# Altium schematic sheet Sheet1.SchDoc
size A
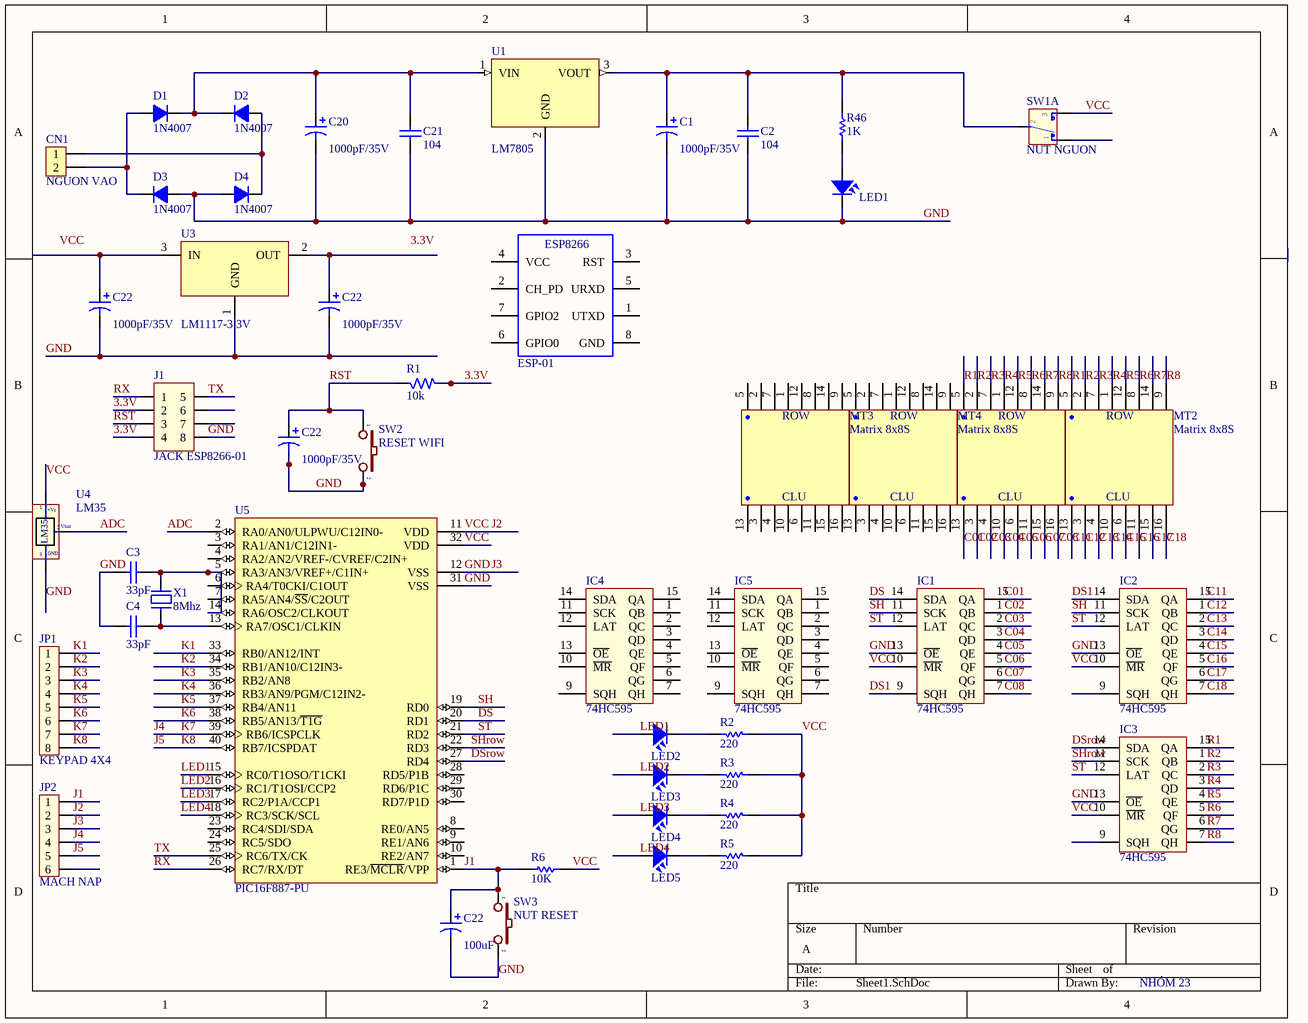
[diagram p0: Sheet1.SchDoc]

## Parts
(Parts that share a designator on the sheet are numbered #1, #2 ... from top to bottom, then left to right.)
C1  value 1000pF/35V  [CP2/5]
C2  104  [CNP]
C3  33pF  [CNP]
C4  33pF  [CNP]
C20  value 1000pF/35V  [CP2/5]
C21  104  [CNP]
C22#1  value 1000pF/35V  [CP2/5]
C22#2  value 1000pF/35V  [CP2/5]
C22#3  value 1000pF/35V  [CP2/5]
C22#4  value 100uF  [CP2/5]
CN1  NGUON VAO  [Header 2x1 straight]
D1  1N4007  [D1A]
D2  1N4007  [D1A]
D3  1N4007  [D1A]
D4  1N4007  [D1A]
IC1  74HC595  [DIP16]
IC2  74HC595  [DIP16]
IC3  74HC595  [DIP16]
IC4  74HC595  [DIP16/W0.3]
IC5  74HC595  [DIP16/W0.3]
J1  JACK ESP8266-01  [JP4x2]
JP1  KEYPAD 4X4  [JP8]
JP2  MACH NAP  [JP6]
LED1  LED  [LED-3]  (value not drawn)
LED2  LED  [LED-3]  (value not drawn)
LED3  LED  [LED-3]  (value not drawn)
LED4  LED  [LED-3]  (value not drawn)
LED5  LED  [LED-3]  (value not drawn)
MT1  Matrix 8x8S  [Matrix]
MT2  Matrix 8x8S  [Matrix]
MT3  Matrix 8x8S  [8x8S]
MT4  Matrix 8x8S  [8x8S]
R1  10k  [SM-RES-1206]
R2  value 220  [R1/4W]  (hidden comment: Res1)
R3  value 220  [R1/4W]  (hidden comment: Res1)
R4  value 220  [R1/4W]  (hidden comment: Res1)
R5  value 220  [R1/4W]  (hidden comment: Res1)
R6  value 10K  [R1/4W]  (hidden comment: Res1)
R46  value 1K  [R1/4W]  (hidden comment: Res1)
SW1  NUT NGUON  [SW6]  (part A of 2)
SW2  RESET WIFI  [SW2]
SW3  NUT RESET  [SW2]
U1  LM7805  [TO-220]
U2  ESP-01  [ESP8266]
U3  LM1117-3.3V  [SOT223]
U4  LM35  [TO92-123]
U5  PIC16F887-PU  [DIP40/W0.6]
X1  8Mhz  [XT2]

## Nets
GND: C1.2 C2.1 C3.2 C4.2 C20.2 C21.1 C22#1.2 C22#2.2 C22#3.2 C22#4.2 D3.1(A) D4.1(A) IC1.8(GND) IC1.13(~{OE}) IC2.8(GND) IC2.13(~{OE}) IC3.8(GND) IC3.13(~{OE}) IC4.8(GND) IC5.8(GND) J1.8 JP2.3 LED1.2 SW2.2 SW3.2 U1.2(GND) U3.1(GND) U4.3(-) U5.12(VSS) U5.31(VSS)  [also labelled J3]
J2: IC1.10(~{MR}) IC1.16(VCC) IC2.10(~{MR}) IC2.16(VCC) IC3.10(~{MR}) IC3.16(VCC) IC4.16(VCC) IC5.16(VCC) JP2.2 R2.1 R3.1 R4.1 R5.1 R6.1 SW1.3 U4.1(+Vs) U5.11(VDD) U5.32(VDD)  [also labelled VCC]
3.3V: J1.2 J1.4 R1.2
ADC: U4.2(Vout) U5.2(RA0/AN0/ULPWU/C12IN0-)
C01: IC1.15(QA) MT1.13(C1)
C02: IC1.1(QB) MT1.3(C2)
C03: IC1.2(QC) MT1.4(C3)
C04: IC1.3(QD) MT1.10(C4)
C05: IC1.4(QE) MT1.6(C5)
C06: IC1.5(QF) MT1.11(C6)
C07: IC1.6(QG) MT1.15(C7)
C08: IC1.7(QH) MT1.16(C8)
C11: IC2.15(QA) MT2.13(C1)
C12: IC2.1(QB) MT2.3(C2)
C13: IC2.2(QC) MT2.4(C3)
C14: IC2.3(QD) MT2.10(C4)
C15: IC2.4(QE) MT2.6(C5)
C16: IC2.5(QF) MT2.11(C6)
C17: IC2.6(QG) MT2.15(C7)
C18: IC2.7(QH) MT2.16(C8)
DS: IC1.14(SDA) U5.20(RD1)
DS1: IC1.9(SQH) IC2.14(SDA)
DSrow: IC3.14(SDA) U5.27(RD4)
J1: C22#4.1 JP2.1 R6.2 SW3.1 U5.1(RE3/~{MCLR}/VPP)
J4: JP1.7 JP2.4 U5.39(RB6/ICSPCLK)  [also labelled K7]
J5: JP1.8 JP2.5 U5.40(RB7/ICSPDAT)  [also labelled K8]
K1: JP1.1 U5.33(RB0/AN12/INT)
K2: JP1.2 U5.34(RB1/AN10/C12IN3-)
K3: JP1.3 U5.35(RB2/AN8)
K4: JP1.4 U5.36(RB3/AN9/PGM/C12IN2-)
K5: JP1.5 U5.37(RB4/AN11)
K6: JP1.6 U5.38(RB5/AN13/~{T1G})
LED1: LED2.1 U5.15(RC0/T1OSO/T1CKI)
LED2: LED3.1 U5.16(RC1/T1OSI/CCP2)
LED3: LED4.1 U5.17(RC2/P1A/CCP1)
LED4: LED5.1 U5.18(RC3/SCK/SCL)
R1: IC3.15(QA) MT1.5(H1) MT2.5(H1)
R2: IC3.1(QB) MT1.2(H2) MT2.2(H2)
R3: IC3.2(QC) MT1.7(H3) MT2.7(H3)
R4: IC3.3(QD) MT1.1(H4) MT2.1(H4)
R5: IC3.4(QE) MT1.12(H5) MT2.12(H5)
R6: IC3.5(QF) MT1.8(H6) MT2.8(H6)
R7: IC3.6(QG) MT1.14(H7) MT2.14(H7)
R8: IC3.7(QH) MT1.9(H8) MT2.9(H8)
RST: C22#3.1 J1.3 R1.1 SW2.1
RX: J1.1 U5.26(RC7/RX/DT)
SH: IC1.11(SCK) IC2.11(SCK) U5.19(RD0)
SHrow: IC3.11(SCK) U5.22(RD3)
ST: IC1.12(LAT) IC2.12(LAT) IC3.12(LAT) U5.21(RD2)
TX: J1.5 U5.25(RC6/TX/CK)
NetC1_1: C1.1 C2.2 R46.2 SW1.2 U1.3(VOUT)
NetC3_1: C3.1 U5.5(RA3/AN3/VREF+/C1IN+) U5.14(RA6/OSC2/CLKOUT) X1.2
NetC4_1: C4.1 U5.13(RA7/OSC1/CLKIN) X1.1
NetC20_1: C20.1 C21.2 D1.2(K) D2.2(K) U1.1(VIN)
NetC22#1_1: C22#1.1 U3.3(IN)
NetC22#2_1: C22#2.1 U3.2(OUT)
NetCN1_1: CN1.1 D2.1(A) D4.2(K)
NetCN1_2: CN1.2 D1.1(A) D3.2(K)
NetLED1_1: LED1.1 R46.1
NetLED2_2: LED2.2 R2.2
NetLED3_2: LED3.2 R3.2
NetLED4_2: LED4.2 R4.2
NetLED5_2: LED5.2 R5.2

Not connected (* = marked no-connect by the designer): IC2 9(SQH); IC3 9(SQH); IC4 1(QB) 2(QC) 3(QD) 4(QE) 5(QF) 6(QG) 7(QH) 9(SQH) 10(~{MR}) 11(SCK) 12(LAT) 13(~{OE}) 14(SDA) 15(QA); IC5 1(QB) 2(QC) 3(QD) 4(QE) 5(QF) 6(QG) 7(QH) 9(SQH) 10(~{MR}) 11(SCK) 12(LAT) 13(~{OE}) 14(SDA) 15(QA); J1 6 7; JP2 6; MT3 1(H4) 2(H2) 3(C2) 4(C3) 5(H1) 6(C5) 7(H3) 8(H6) 9(H8) 10(C4) 11(C6) 12(H5) 13(C1) 14(H7) 15(C7) 16(C8); MT4 1(H4) 2(H2) 3(C2) 4(C3) 5(H1) 6(C5) 7(H3) 8(H6) 9(H8) 10(C4) 11(C6) 12(H5) 13(C1) 14(H7) 15(C7) 16(C8); SW1 1; U2 1(UTXD) 2(CH_PD) 3(RST) 4(VCC) 5(URXD) 6(GPIO0) 7(GPIO2) 8(GND); U5 3(RA1/AN1/C12IN1-) 4(RA2/AN2/VREF-/CVREF/C2IN+) 6(RA4/T0CKI/C1OUT) 7(RA5/AN4/~{SS}/C2OUT) 8(RE0/AN5) 9(RE1/AN6) 10(RE2/AN7) 23(RC4/SDI/SDA) 24(RC5/SDO) 28(RD5/P1B) 29(RD6/P1C) 30(RD7/P1D)

## Notes on the sheet
- NHÓM 23
- Labels drawn without touching a wire or pin: 3.3V, VCC
- (in symbol ESP8266-01) ESP8266
- (in symbol LED 8x8S) ROW; CLU
- (in symbol LM35) GND

## Library data of the parts
C1 C20 = Cap Pol3_2: Polarized Capacitor (Surface Mount); VALUE: C?; LatestRevisionDate: 17-Jul-2002; LatestRevisionNote: Re-released for DXP Platform.; PackageReference: C0805; Publisher: Altium Limited
C2 C21 = Cap Semi_2: Capacitor (Semiconductor SIM Model); LatestRevisionDate: 17-Jul-2002; LatestRevisionNote: Re-released for DXP Platform.; PackageReference: C1206; Publisher: Altium Limited; Value: 104
C3 C4 = Cap Semi_2: Capacitor (Semiconductor SIM Model); Value: 104; LatestRevisionDate: 17-Jul-2002; LatestRevisionNote: Re-released for DXP Platform.; PackageReference: C1206; Publisher: Altium Limited
C22#1-C22#4 = Cap Pol3: Polarized Capacitor (Surface Mount); VALUE: C?; LatestRevisionDate: 17-Jul-2002; LatestRevisionNote: Re-released for DXP Platform.; PackageReference: C0805; Publisher: Altium Limited
CN1 = Header 2x1: 2.54mm
D1-D4 = D1A: Diode 1A; Value: 1N4007
IC1-IC5 = 74595: 8 Bit Serial input - Parallel Output; Value: 74HC595
J1 = JP4x2: Connector 4x2; Value: Connector 4x2
JP1 = JP8: JP8 PIN; Value: JP7
JP2 = JP6: JP6 PIN; Value: JP7
LED1-LED5 = LED: LED Single colour Green and Red; Value: LED 3 ly Single Colour
MT1-MT4 = LED 8x8S: Matrix 8x8,  Single colour; Value: Matrix 8x8S
R1 = R: Resistor 1/4W; Value: R1/4W - 1K
R2-R6 R46 = Res1_4: Resistor; Manufacturer: Generic Components; Class: Passive; Published: 08/06/2000; Publisher: Altium Hobart Technology Centre; SubClass: Resistor
SW1 = SW6A: SW-DTDP - 6 Pin; Value: SW6
SW2 SW3 = SW2: Switch button 2 pin; Value: SW chip 2 pin
U1 = LM7805: TO-220; Text Field1: 70; Text Field2: 30
U2 = ESP8266-01: ESP-12 Wi-Fi Module
U3 = LM1117: 800mA Low-Dropout Linear Regulator; Creator: Nguyen Ba Bien; Website: http://group3i.net
U4 = LM35: Teminal; Value: LM35
U5 = PIC16F887-PU: Flash-Based, 8-Bit CMOS Microcontroller with nanoWatt Technology, 8K (x14-Bit words) Program Memory, 624 Bytes Data Memory, 35 I/O pins, 40-Pin PDIP, Standard VDD Range, Extended Temperature; Published: 29-Jan-2009; LatestRevisionDate: 02-Dec-2009; LatestRevisionNote: Updated datasheet to version revF, Apr-2009.; DatasheetVersion: revF, Apr-2009; PackageVersion: revBB, Aug-2009; PackageReference: PDIP600-P40; Publisher: Altium Limited; PackageDescription: 40-Lead Plastic Dual In-Line (P) - 600 mil Body [PDIP]; Supplier 1: Digi-Key; Supplier Part Number 1: PIC16F887-E/P-ND; Supplier 2: Farnell; Supplier Part Number 2: 1703423; ComponentLink1Description: Datasheet; ComponentLink1URL: http://ww1.microchip.com/downloads/en/DeviceDoc/41291F.pdf; ComponentLink2Description: Packaging Specification; ComponentLink2URL: http://www.microchip.com/stellent/groups/techpub_sg/documents/packagingspec/en012702.pdf; ComponentLink3Description: Microchip.com Home; ComponentLink3URL: http://www.microchip.com/
X1 = XT2: Crystal For all Crystal 2pin.; Value: 4Mhz